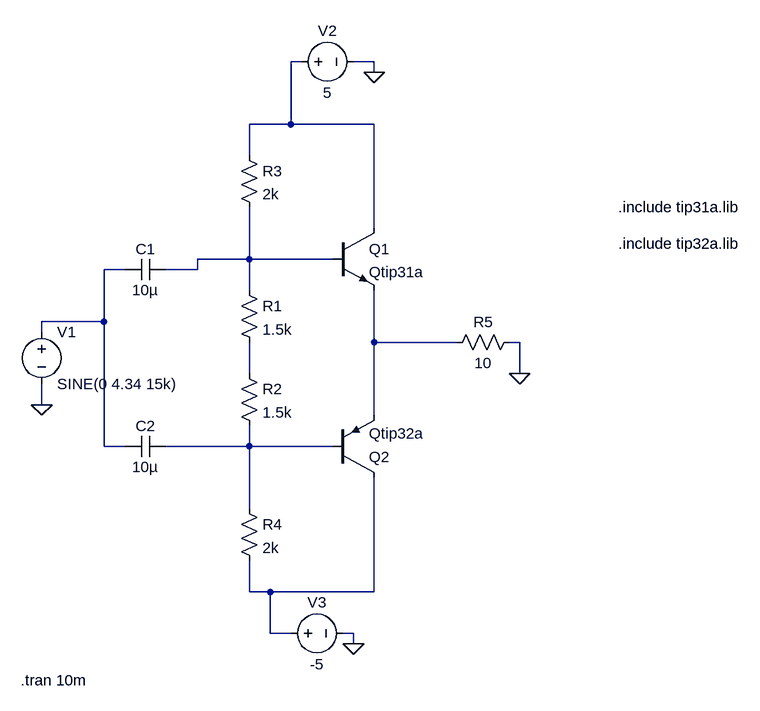
[diagram p0: schematic POWERAMPLIFIER.asc]
POWERAMPLIFIER.asc, the LTspice schematic file:
Version 4.1
SHEET 1 880 792
WIRE 144 -176 128 -176
WIRE 256 -176 224 -176
WIRE 256 -160 256 -176
WIRE 128 -80 128 -176
WIRE 128 -80 64 -80
WIRE 256 -80 128 -80
WIRE 64 -32 64 -80
WIRE 256 80 256 -80
WIRE 64 128 64 48
WIRE 64 128 -16 128
WIRE 192 128 64 128
WIRE -128 144 -160 144
WIRE -16 144 -16 128
WIRE -16 144 -64 144
WIRE 64 176 64 128
WIRE -160 224 -160 144
WIRE -160 224 -256 224
WIRE -256 240 -256 224
WIRE 256 256 256 176
WIRE 384 256 256 256
WIRE 480 256 464 256
WIRE 64 304 64 256
WIRE 480 304 480 256
WIRE -256 352 -256 320
WIRE 256 368 256 256
WIRE -160 416 -160 224
WIRE -128 416 -160 416
WIRE 64 416 64 384
WIRE 64 416 -64 416
WIRE 192 416 64 416
WIRE 64 512 64 416
WIRE 64 640 64 592
WIRE 96 640 64 640
WIRE 256 640 256 464
WIRE 256 640 96 640
WIRE 96 704 96 640
WIRE 128 704 96 704
WIRE 224 704 208 704
WIRE 224 720 224 704
FLAG -256 352 0
FLAG 224 720 0
FLAG 256 -160 0
FLAG 480 304 0
SYMBOL npn 192 80 R0
SYMATTR InstName Q1
SYMATTR Value Qtip31a
SYMBOL pnp 192 464 M180
SYMATTR InstName Q2
SYMATTR Value Qtip32a
SYMBOL res 48 160 R0
SYMATTR InstName R1
SYMATTR Value 1.5k
SYMBOL res 48 288 R0
SYMATTR InstName R2
SYMATTR Value 1.5k
SYMBOL res 48 -48 R0
SYMATTR InstName R3
SYMATTR Value 2k
SYMBOL res 48 496 R0
SYMATTR InstName R4
SYMATTR Value 2k
SYMBOL cap -64 128 R90
WINDOW 0 0 32 VBottom 2
WINDOW 3 32 32 VTop 2
SYMATTR InstName C1
SYMATTR Value 10µ
SYMBOL cap -64 400 R90
WINDOW 0 0 32 VBottom 2
WINDOW 3 32 32 VTop 2
SYMATTR InstName C2
SYMATTR Value 10µ
SYMBOL res 480 240 R90
WINDOW 0 0 56 VBottom 2
WINDOW 3 32 56 VTop 2
SYMATTR InstName R5
SYMATTR Value 10
SYMBOL voltage -256 224 R0
WINDOW 123 0 0 Left 0
WINDOW 39 0 0 Left 0
SYMATTR InstName V1
SYMATTR Value SINE(0 4.34 15k)
SYMBOL voltage 128 -176 R270
WINDOW 0 32 56 VTop 2
WINDOW 3 -32 56 VBottom 2
SYMATTR InstName V2
SYMATTR Value 5
SYMBOL voltage 112 704 R270
WINDOW 0 32 56 VTop 2
WINDOW 3 -32 56 VBottom 2
SYMATTR InstName V3
SYMATTR Value -5
TEXT 632 48 Left 2 !.include tip31a.lib
TEXT 632 104 Left 2 !.include tip32a.lib
TEXT -288 776 Left 2 !.tran 10m

The netlist it stands for:
* POWERAMPLIFIER.asc
Q1 N001 N002 N004 0 Qtip31a
Q2 N007 N006 N004 0 Qtip32a
R1 N002 N005 1.5k
R2 N005 N006 1.5k
R3 N001 N002 2k
R4 N006 N007 2k
C1 N002 N003 10µ
C2 N006 N003 10µ
R5 0 N004 10
V1 N003 0 SINE(0 4.34 15k)
V2 N001 0 5
V3 N007 0 -5
.model NPN NPN
.model PNP PNP
.lib standard.bjt
.include tip31a.lib
.include tip32a.lib
.tran 10m
.backanno
.end